# Altium schematic sheet Stepmotor_schematic.SchDoc
size A3
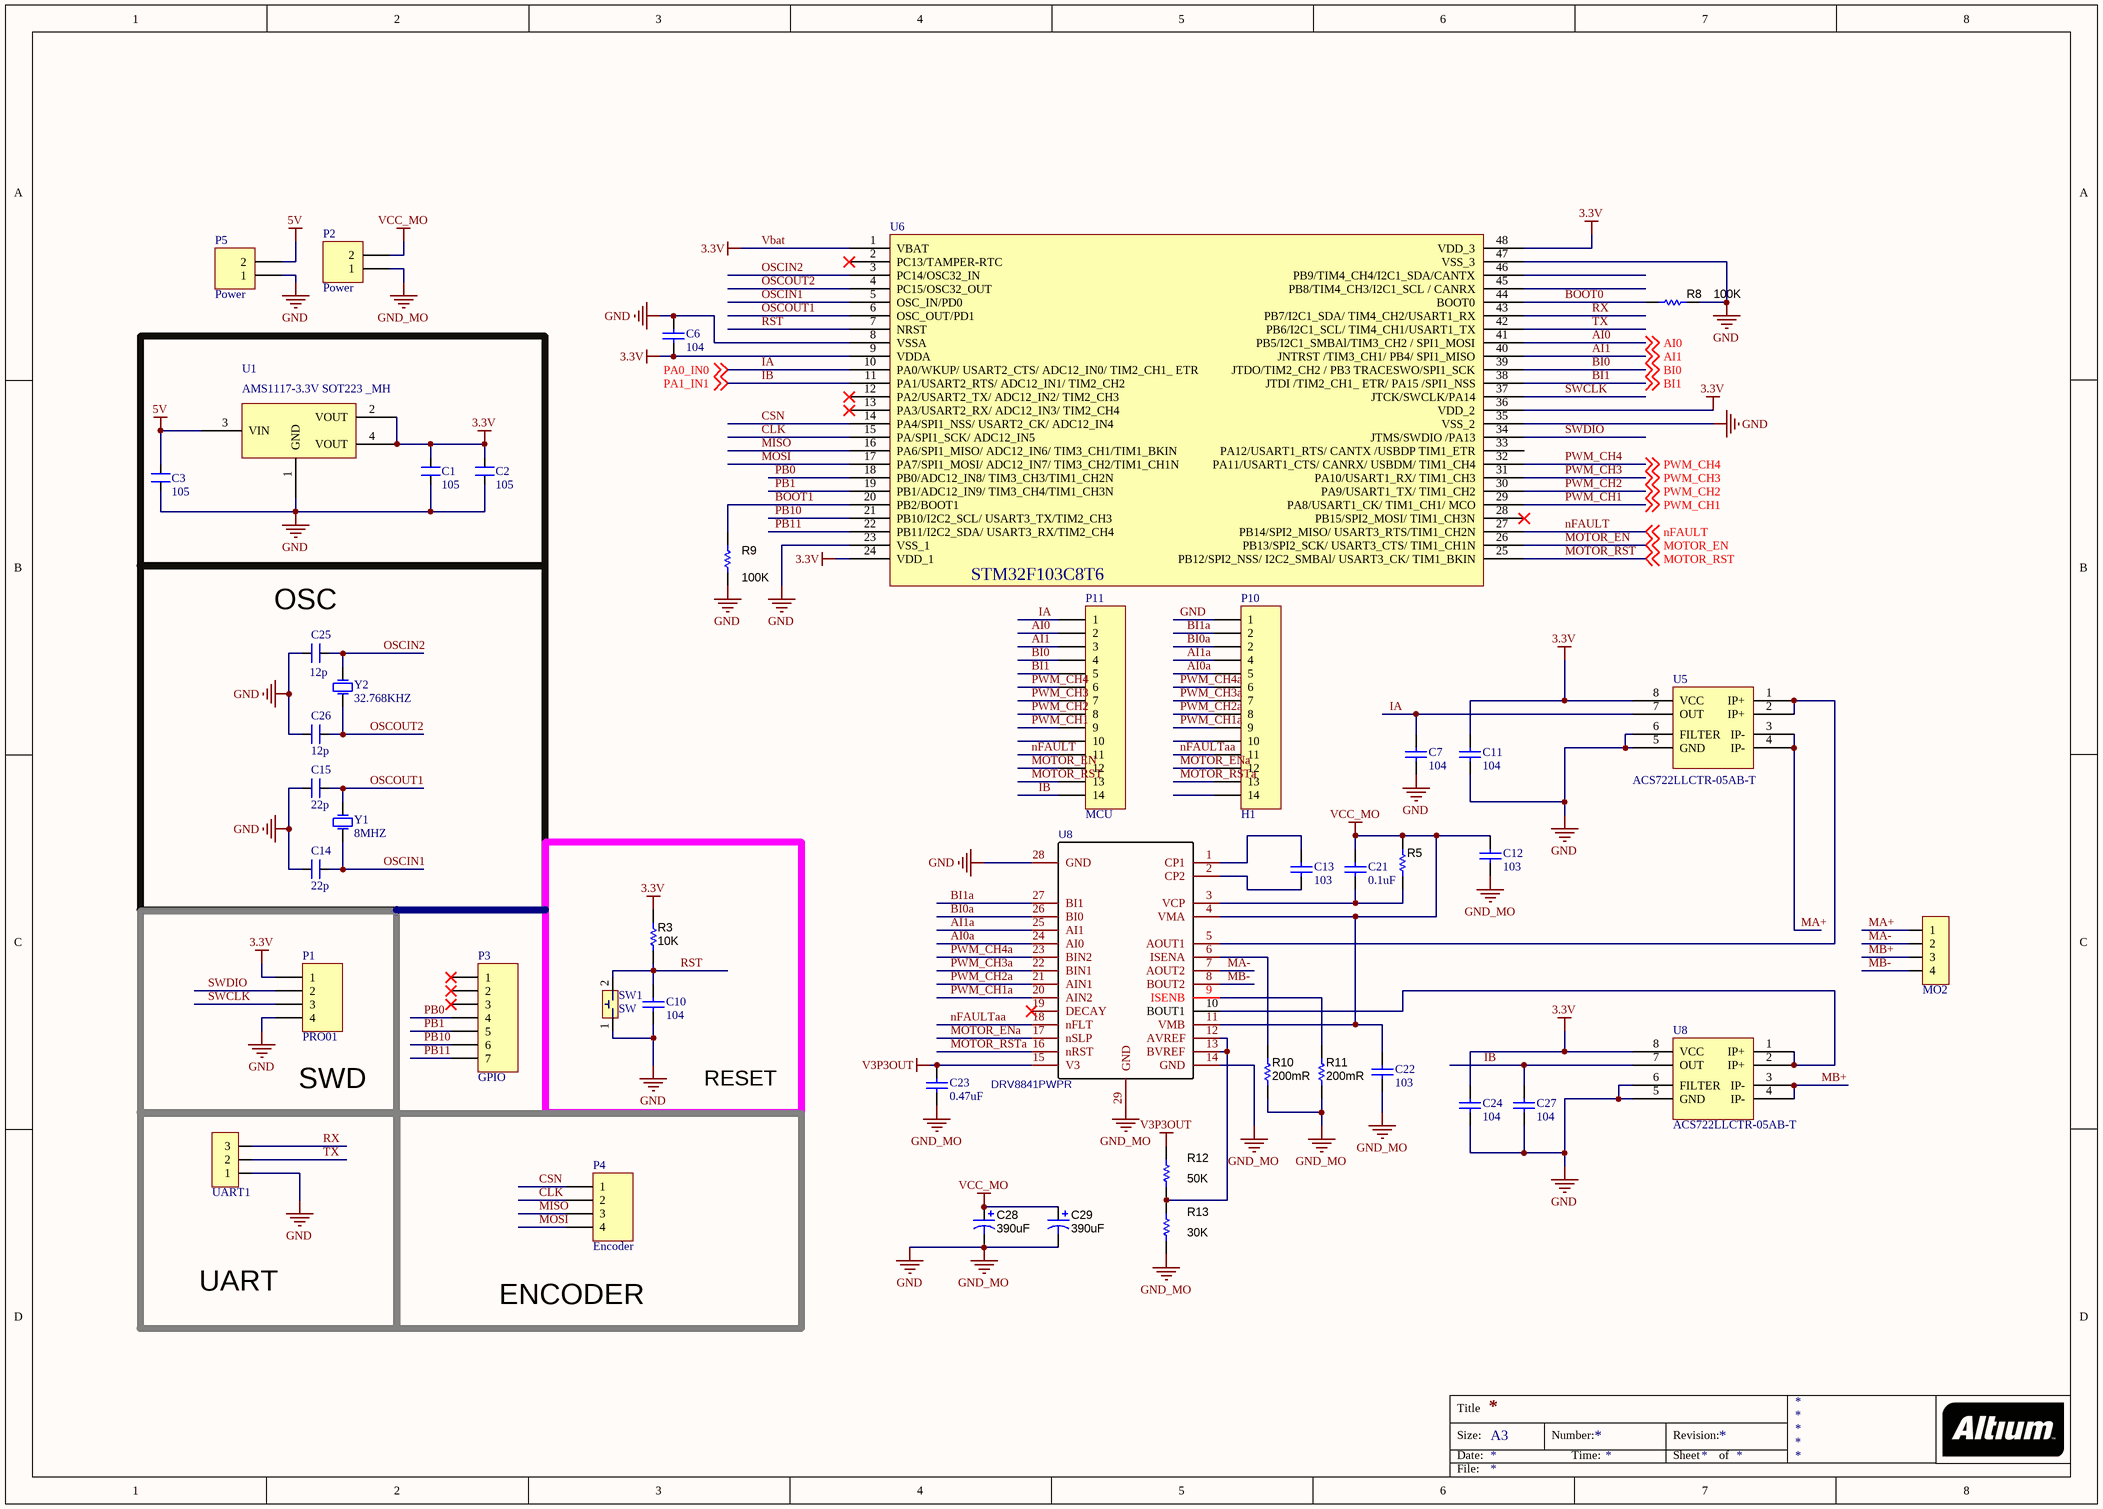
[diagram p0: Stepmotor_schematic.SchDoc]

## Parts
(Parts that share a designator on the sheet are numbered #1, #2 ... from top to bottom, then left to right.)
C1  105  [0805_HV]
C2  105  [0805_HV]
C3  105  [0805_HV]
C6  104  [0805_HV]
C7  104  [0805_HV]
C10  104  [0805_HV]
C11  104  [0805_HV]
C12  103  [0805_HV]
C13  103  [0805_HV]
C14  22p  [0805_HV]
C15  22p  [0805_HV]
C21  0.1uF  [0805_HV]
C22  103  [0805_HV]
C23  0.47uF  [0805_HV]
C24  104  [0805_HV]
C25  12p  [0805_HV]
C26  12p  [0805_HV]
C27  104  [0805_HV]
C28  390uF  [CP1/3.0]
C29  390uF  [CP1/3.0]
MO2  Header 4_MH  [HEADER 4]  (value not drawn)
P1  PRO01  [HDR1X4]
P2  Power  [HDR1X2]
P3  GPIO  [HDR1X7]
P4  Encoder  [HDR1X4]
P5  Power  [HDR1X2]
P10  H1  [HDR1X14]
P11  MCU  [HDR1X14]
R3  10K  [0805_HV]
R5  (no value)  [0805_HV]
R8  100K  [0805_HV]
R9  100K  [0805_HV]
R10  ValueDisplayed: 200mR  [1210]  (hidden comment: RT0603DRE07140KL)
R11  ValueDisplayed: 200mR  [1210]  (hidden comment: RT0603DRE07140KL)
R12  50K  [0805_HV]
R13  30K  [0805_HV]
SW1  SW  [BUTTON SMD 2]
U1  AMS1117-3.3V SOT223 _MH  [SOT223]
U5  ACS722LLCTR-05AB-T  [SO-8]
U6  STM32F103C8T6 LQFP48 _MH  [LQFP48]  (value not drawn)
U8#1  DRV8841PWPR  [TSSOP-28EP]
U8#2  ACS722LLCTR-05AB-T  [SO-8]
UART1  Header 3_MH  [HEADER 3]  (value not drawn)
Y1  8MHZ  [XTAL 49S SMD]
Y2  32.768KHZ  [XT32kn]

## Blocks framed on the sheet
OSC: C14 C15 C25 C26 Y1 Y2
RESET: C10 R3 SW1
SWD: P1
UART: UART1
ENCODER: P4

## Nets
5V: C3.2 P5.2 U1.3(VIN)
GND: C1.1 C2.1 C3.1 C6.1 C7.1 C10.1 C11.1 C12.1 C14.1 C15.1 C22.1 C23.1 C24.1 C25.1 C26.1 C27.1 C28.2(-) C29.2(-) P1.4 P2.1 P5.1 P10.1 R8.1 R9.2 R10.1 R11.1 R13.1 SW1.1 U1.1(GND) U5.5(GND) U5.6(FILTER) U6.8(VSSA) U6.23(VSS_1) U6.35(VSS_2) U6.47(VSS_3) U8#1.14(GND) U8#1.28(GND) U8#1.29(GND) U8#2.5(GND) U8#2.6(FILTER) UART1.1  [also labelled GND_MO]
V3P3OUT: C23.2 R12.2 U8#1.15(V3)
Vbat: C1.2 C2.2 C6.2 C11.2 C24.2 P1.1 R3.2 U1.2(VOUT) U1.4(VOUT) U5.8(VCC) U6.1(VBAT) U6.9(VDDA) U6.24(VDD_1) U6.36(VDD_2) U6.48(VDD_3) U8#2.8(VCC)  [also labelled 3.3V]
VCC_MO: C12.2 C21.2 C22.2 C28.1(+) C29.1(+) P2.2 R5.2 U8#1.4(VMA) U8#1.11(VMB)
AI0: P11.2 U6.41(PB5/I2C1_SMBAl/TIM3_CH2_/_SPI1_MOSI) ; off-sheet AI0
AI0a: P10.5 U8#1.24(AI0)
AI1: P11.3 U6.40(JNTRST_/TIM3_CH1/_PB4/_SPI1_MISO) ; off-sheet AI1
AI1a: P10.4 U8#1.25(AI1)
BI0: P11.4 U6.39(JTDO/TIM2_CH2_/_PB3_TRACESWO/SPI1_SCK) ; off-sheet BI0
BI0a: P10.2 U8#1.26(BI0)
BI1: P11.5 U6.38(JTDI_/TIM2_CH1__ETR/_PA15_/SPI1_NSS) ; off-sheet BI1
BI1a: P10.2 U8#1.27(BI1)
BOOT0: R8.2 U6.44(BOOT0)
BOOT1: R9.1 U6.20(PB2/BOOT1)
CLK: P4.2 U6.15(PA/SPI1_SCK/_ADC12_IN5)
CSN: P4.1 U6.14(PA4/SPI1_NSS/_USART2_CK/_ADC12_IN4)
IA: C7.2 P11.1 U5.7(OUT) U6.10(PA0/WKUP/_USART2_CTS/_ADC12_IN0/_TIM2_CH1__ETR) ; off-sheet PA0_IN0  [also labelled PA0_IN0]
IB: C27.2 P11.14 U6.11(PA1/USART2_RTS/_ADC12_IN1/_TIM2_CH2) U8#2.7(OUT) ; off-sheet PA1_IN1  [also labelled PA1_IN1]
MA+: MO2.1 U5.3(IP-) U5.4(IP-)
MA-: MO2.2 U8#1.7(AOUT2)
MB+: MO2.3 U8#2.3(IP-) U8#2.4(IP-)
MB-: MO2.4 U8#1.8(BOUT2)
MISO: P4.3 U6.16(PA6/SPI1_MISO/_ADC12_IN6/_TIM3_CH1/TIM1_BKIN)
MOSI: P4.4 U6.17(PA7/SPI1_MOSI/_ADC12_IN7/_TIM3_CH2/TIM1_CH1N)
MOTOR_EN: P11.12 U6.26(PB13/SPI2_SCK/_USART3_CTS/_TIM1_CH1N) ; off-sheet MOTOR_EN
MOTOR_ENa: P10.12 U8#1.17(nSLP)
MOTOR_RST: P11.13 U6.25(PB12/SPI2_NSS/_I2C2_SMBAl/_USART3_CK/_TIM1_BKIN) ; off-sheet MOTOR_RST
MOTOR_RSTa: P10.13 U8#1.16(nRST)
nFAULT: P11.11 U6.27(PB14/SPI2_MISO/_USART3_RTS/TIM1_CH2N) ; off-sheet nFAULT
nFAULTaa: P10.11 U8#1.18(nFLT)
OSCIN1: C14.2 U6.5(OSC_IN/PD0) Y1.2(OSC2)
OSCIN2: C25.2 U6.3(PC14/OSC32_IN) Y2.1(OSC1)
OSCOUT1: C15.2 U6.6(OSC_OUT/PD1) Y1.1(OSC1)
OSCOUT2: C26.2 U6.4(PC15/OSC32_OUT) Y2.2(OSC2)
PB0: P3.4 U6.18(PB0/ADC12_IN8/_TIM3_CH3/TIM1_CH2N)
PB1: P3.5 U6.19(PB1/ADC12_IN9/_TIM3_CH4/TIM1_CH3N)
PB10: P3.6 U6.21(PB10/I2C2_SCL/_USART3_TX/TIM2_CH3)
PB11: P3.7 U6.22(PB11/I2C2_SDA/_USART3_RX/TIM2_CH4)
PWM_CH1: P11.9 U6.29(PA8/USART1_CK/_TIM1_CH1/_MCO) ; off-sheet PWM_CH1
PWM_CH1a: P10.9 U8#1.20(AIN2)
PWM_CH2: P11.8 U6.30(PA9/USART1_TX/_TIM1_CH2) ; off-sheet PWM_CH2
PWM_CH2a: P10.8 U8#1.21(AIN1)
PWM_CH3: P11.7 U6.31(PA10/USART1_RX/_TIM1_CH3) ; off-sheet PWM_CH3
PWM_CH3a: P10.7 U8#1.22(BIN1)
PWM_CH4: P11.6 U6.32(PA11/USART1_CTS/_CANRX/_USBDM/_TIM1_CH4) ; off-sheet PWM_CH4
PWM_CH4a: P10.6 U8#1.23(BIN2)
RST: C10.2 R3.1 SW1.2 U6.7(NRST)
RX: U6.43(PB7/I2C1_SDA/_TIM4_CH2/USART1_RX) UART1.3
SWCLK: P1.3 U6.37(JTCK/SWCLK/PA14)
SWDIO: P1.2 U6.34(JTMS/SWDIO_/PA13)
TX: U6.42(PB6/I2C1_SCL/_TIM4_CH1/USART1_TX) UART1.2
NetC13_1: C13.1 U8#1.2(CP2)
NetC13_2: C13.2 U8#1.1(CP1)
NetC21_1: C21.1 R5.1 U8#1.3(VCP)
NetR10_2: R10.2 U8#1.6(ISENA)
NetR11_2: R11.2 U8#1.9(ISENB)
NetR12_1: R12.1 R13.2 U8#1.12(AVREF) U8#1.13(BVREF)
NetU5_1: U5.1(IP+) U5.2(IP+) U8#1.5(AOUT1)
NetU8#1_10: U8#1.10(BOUT1) U8#2.1(IP+) U8#2.2(IP+)

Not connected (* = marked no-connect by the designer): P3 1* 2* 3*; P10 10 14; P11 10; U6 2(PC13/TAMPER-RTC)* 12(PA2/USART2_TX/_ADC12_IN2/_TIM2_CH3)* 13(PA3/USART2_RX/_ADC12_IN3/_TIM2_CH4)* 28(PB15/SPI2_MOSI/_TIM1_CH3N)* 33(PA12/USART1_RTS/_CANTX_/USBDP_TIM1_ETR) 45(PB8/TIM4_CH3/I2C1_SCL_/_CANRX) 46(PB9/TIM4_CH4/I2C1_SDA/CANTX); U8#1 19(DECAY)*

## Notes on the sheet
- Title
- Size:
- Date:
- A3
- Number:
- Time:
- Revision:
- Sheet
- of
- File:
- (in symbol STM32F103C8T6 LQFP48 _MH) STM32F103C8T6

## Library data of the parts
C1-C3 C14 C15 C25 C26 = CM: Cap SMD; Value: 103
C6 C7 C10-C13 C21-C24 C27 = Capacitor 0805: Ceramic Chip Capacitor - Standard; Note: Footprint corresponds to dimensions for bulk cassette packaging. This case size has tightened tolerances.; Published: 17-Jul-2002; LatestRevisionDate: 19-Mar-2004; LatestRevisionNote: Silkscreen size reduced.; DatasheetDocument: Mar-2001; PackageDocument: Mar-2001; PackageReference: 0805; Publisher: Altium Limited; Code_JEITA: 0805; Code_IPC: 2012[0805]; ComponentLink1Description: Manufacturer Link; ComponentLink1URL: http://www.kemet.com/; ComponentLink2Description: Datasheet; ComponentLink2URL: http://www.kemet.com/kemet/web/homepage/kechome.nsf/vapubfilesname/F3102TA.pdf/$file/F3102TA.pdf
  C6 C7 C10 C11 C24 C27: Value: 104
  C12 C13 C22: Value: 103
  C21: Value: 0.1uF
  C23: Value: 0.47uF
C28 C29 = Capacitor TuHoa: PartNumber: UHW1H391MPD6; Manufacturer: Nichicon; Polarized: Y; U/M: EA; Cap_F: 0.000390; Tolerance_%: 20; Value1: Unknown; VDC_V: 50; Value2: 50V; TaMin_C: -40; TaMax_C: 105; Cap_Case: 10x22; AEC Category: Q200; AEC Qualified: N; CompType: Capacitor; SymbolVersion: 2008-07-09; Value: 390uF; PackageReference: 10x22; RoHS: Y; MountType: TH; Technology: AL; Series: ZL; Publisher: Texas Instruments; LatestRevisionDate: 2015-12-17; ComponentLink1Description: Datasheet link; ComponentLink1URL: http://nichicon-us.com/english/products/pdfs/e-uhw.pdf; Supplier 1: Digi-Key; Supplier Part Number 1: 493-6885-ND; AEC Grade: N/A; ValueDisplayed: 390uF
MO2 = Header 4_MH: Header 4P XH2.54 thẳng
P1 P4 = Header 4: Header, 4-Pin; LatestRevisionDate: 17-Jul-2002; LatestRevisionNote: Re-released for DXP Platform.; Publisher: Altium Limited
P2 P5 = Header 2: Header, 2-Pin; LatestRevisionDate: 17-Jul-2002; LatestRevisionNote: Re-released for DXP Platform.; Publisher: Altium Limited
P3 = Header 7H: Header, 7-Pin, Right Angle; LatestRevisionDate: 17-Jul-2002; LatestRevisionNote: Re-released for DXP Platform.; Publisher: Altium Limited
P10 P11 = Header 14: Header, 14-Pin; LatestRevisionDate: 17-Jul-2002; LatestRevisionNote: Re-released for DXP Platform.; Publisher: Altium Limited
R3 R5 R8 R9 R12 R13 = R nho: RES, 100, 1%, 0.1 W, 0402; PartNumber: ERJ-2RKF1000X; Manufacturer: Panasonic; CompType: Resistor; Res_ohm: 100; Value_Code: 100R; Tolerance_%: 1; Power_W: 0.1; Value2: 0.1W; VDC_V: 50; TempCo: 100 ppm/C; EIA_Code: E96; U/M: EA; AEC Category: Q200; SymbolVersion: 2009-05-29; PackageReference: 0402; RoHS: Y; Value1: 1%; MountType: SMT; Technology: Thick Film; Published: 2008-06-26; Publisher: Texas Instruments; LatestRevisionDate: 2016-01-08; ComponentLink1Description: Datasheet link; ComponentLink1URL: http://industrial.panasonic.com/www-data/pdf/AOA0000/AOA0000CE2.pdf; Supplier 1: Digi-Key; Supplier Part Number 1: P100LCT-ND; Supplier 2: Mouser; Supplier Part Number 2: 667-ERJ-2RKF1000X; Supplier 3: Farnell; Supplier Part Number 3: 2304034; AEC Qualified: ?
  R3: Value: 10K
  R8 R9: Value: 100K
  R12: Value: 50K
  R13: Value: 30K
R10 R11 = RT0603DRE07140KL: RES, 140 k, 0.5%, 0.1 W, 0603; Manufacturer: Yageo America; CompType: Resistor; Value: 140k; Res_ohm: 140000; Tolerance_%: 0.5; Power_W: 0.1; Value2: 0.1W; VDC_V: 75; TempCo: 50 ppm/C; EIA_Code: E192; U/M: EA; SymbolVersion: 2009-05-29; PartNumber: RT0603DRE07140KL; PackageReference: 0603; RoHS: Y; Value_Code: 140k; Value1: 0.5%; MountType: SMT; Technology: Thin Film; Published: 2008-06-26; Publisher: Texas Instruments; LatestRevisionDate: 2014-09-19; ComponentLink1Description: Datasheet link; ComponentLink1URL: http://www.yageo.com/pdf/PYu-RT_1-to-0.05_RoHS_L_3.pdf
SW1 = BUTTON 2P SMD_MH: Nút nhấn 2 chân, dán
U5 U8#2 = ACS712
U8#1 = DRV8841PWPR: BOM_Manufacturer: TI; SMT Type: Extend; BOM_Supplier: LCSC; BOM_Manufacturer Part: DRV8841PWPR; image: //image.lceda.cn/szlcsc/C36542.jpg; BOM_Supplier Part: C36542; BOM_LCSC Assembly: Yes; spicePre: U
UART1 = Header 3_MH: Header 3P XH2.54 thẳng
Y1 Y2 = CRYSTAL_49S DIP_MH: Crystal Oscillator; Published: 8-Jun-2000; LatestRevisionDate: 17-Jul-2002; LatestRevisionNote: Re-released for DXP Platform.; PackageReference: R38; Publisher: Altium Limited